# EAGLE design G021dec (EAGLE 6.6.0)
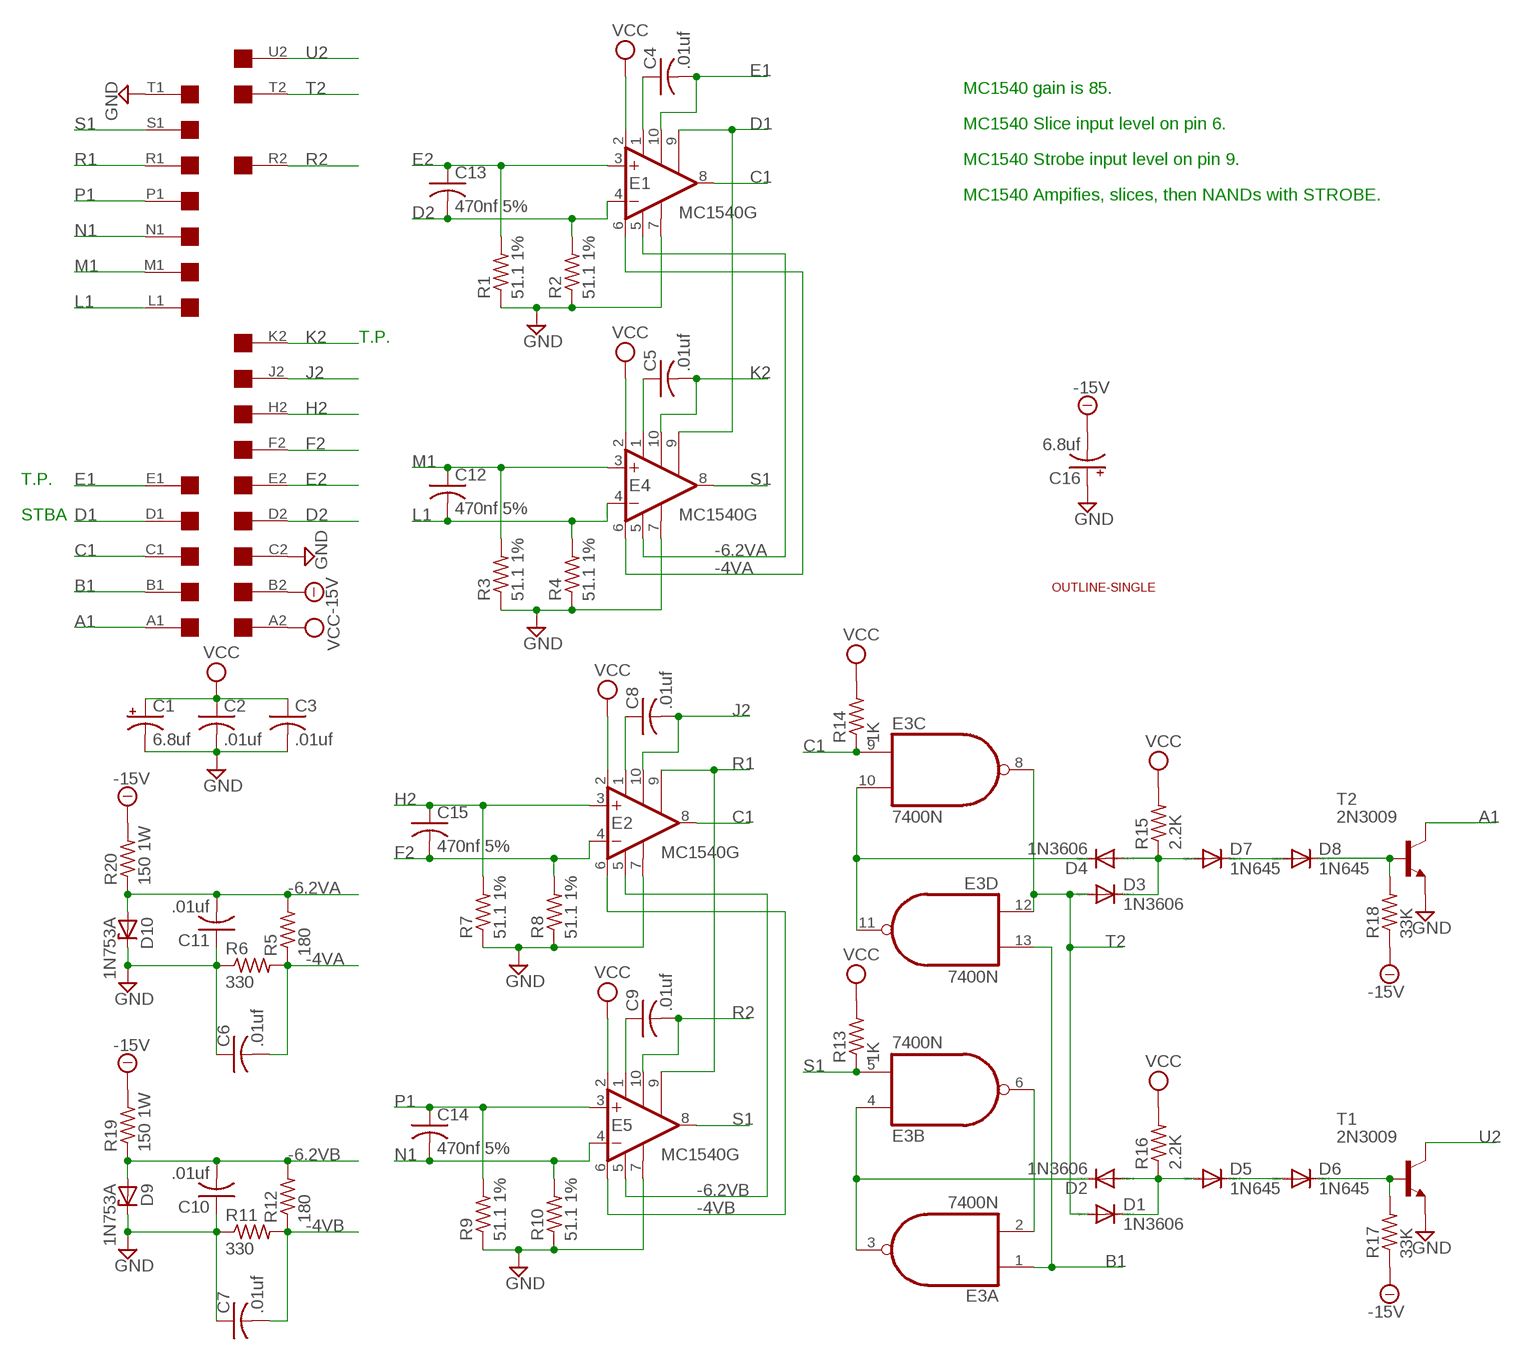
[diagram p0: schematic, sheet 1]

## Parts
C1  6.8uf  CPOL-USE15-5AXIAL  [E15-5]
C2  .01uf  C-US050-025X075  [C050-025X075]
C3  .01uf  C-US050-025X075  [C050-025X075]
C4  .01uf  C-US050-025X075  [C050-025X075]
C5  .01uf  C-US050-025X075  [C050-025X075]
C6  .01uf  C-US050-025X075  [C050-025X075]
C7  .01uf  C-US050-025X075  [C050-025X075]
C8  .01uf  C-US050-025X075  [C050-025X075]
C9  .01uf  C-US050-025X075  [C050-025X075]
C10  .01uf  C-US050-025X075  [C050-025X075]
C11  .01uf  C-US050-025X075  [C050-025X075]
C12  470nf 5%  C-US050-025X075  [C050-025X075]
C13  470nf 5%  C-US050-025X075  [C050-025X075]
C14  470nf 5%  C-US050-025X075  [C050-025X075]
C15  470nf 5%  C-US050-025X075  [C050-025X075]
C16  6.8uf  CPOL-USE15-5AXIAL  [E15-5]
D1  1N3606  1N4148DO35-10  [DO35-10]
D2  1N3606  1N4148DO35-10  [DO35-10]
D3  1N3606  1N4148DO35-10  [DO35-10]
D4  1N3606  1N4148DO35-10  [DO35-10]
D5  1N645  1N4148DO35-10  [DO35-10]
D6  1N645  1N4148DO35-10  [DO35-10]
D7  1N645  1N4148DO35-10  [DO35-10]
D8  1N645  1N4148DO35-10  [DO35-10]
D9  1N753A  ZENER-DIODEF126-10  [F126Z10]
D10  1N753A  ZENER-DIODEF126-10  [F126Z10]
E1  MC1540G  [602B]
E2  MC1540G  [602B]
E3  7400N  [DIL14]
E4  MC1540G  [602B]
E5  MC1540G  [602B]
R1  51.1 1%  R-US_0207/10  [0207/10]
R2  51.1 1%  R-US_0207/10  [0207/10]
R3  51.1 1%  R-US_0207/10  [0207/10]
R4  51.1 1%  R-US_0207/10  [0207/10]
R5  180  R-US_0207/10  [0207/10]
R6  330  R-US_0207/10  [0207/10]
R7  51.1 1%  R-US_0207/10  [0207/10]
R8  51.1 1%  R-US_0207/10  [0207/10]
R9  51.1 1%  R-US_0207/10  [0207/10]
R10  51.1 1%  R-US_0207/10  [0207/10]
R11  330  R-US_0207/10  [0207/10]
R12  180  R-US_0207/10  [0207/10]
R13  1K  R-US_0207/10  [0207/10]
R14  1K  R-US_0207/10  [0207/10]
R15  2.2K  R-US_0207/10  [0207/10]
R16  2.2K  R-US_0207/10  [0207/10]
R17  33K  R-US_0207/10  [0207/10]
R18  33K  R-US_0207/10  [0207/10]
R19  150 1W  R-US_0414/15  [0414/15]
R20  150 1W  R-US_0414/15  [0414/15]
T1  2N3009  2N3565  [TO92]
T2  2N3009  2N3565  [TO92]
U$1  SINGLE  [EDGE-CON2]
U$2  OUTLINE-SINGLE  [SINGLE]

## Nets
-4VA: C6.2 E1.6(SLICE) E4.6(SLICE) R5.1 R6.2
-4VB: C7.2 E2.6(SLICE) E5.6(SLICE) R11.2 R12.1
-6.2VA: C11.2 D10.A E1.5(V-) E4.5(V-) R5.2 R20.1
-6.2VB: C10.2 D9.A E2.5(V-) E5.5(V-) R12.2 R19.1
-15V: C16.- R17.1 R18.1 R19.2 R20.2 U$1.B2
A1: T2.1(C) U$1.A1
B1: E3.1(A:I0) E3.13(D:I1) U$1.B1
C1: E1.8(OUT) E2.8(OUT) E3.9(C:I0) R14.1 U$1.C1
D1: E1.9(ISTROBE) E4.9(ISTROBE) U$1.D1
D2: C13.2 E1.4(-IN) R2.2 U$1.D2
E1: C4.2 E1.10(CEXTB) U$1.E1
E2: C13.1 E1.3(+IN) R1.2 U$1.E2
F2: C15.2 E2.4(-IN) R8.2 U$1.F2
GND [supply]: C1.- C2.2 C3.2 C6.1 C7.1 C10.1 C11.1 C16.+ D9.C D10.C E1.7(GND) E2.7(GND) E4.7(GND) E5.7(GND) R1.1 R2.1 R3.1 R4.1 R6.1 R7.1 R8.1 R9.1 R10.1 R11.1 T1.3(E) T2.3(E) U$1.C2 U$1.T1
H2: C15.1 E2.3(+IN) R7.2 U$1.H2
J2: C8.2 E2.10(CEXTB) U$1.J2
K2: C5.2 E4.10(CEXTB) U$1.K2
L1: C12.2 E4.4(-IN) R4.2 U$1.L1
M1: C12.1 E4.3(+IN) R3.2 U$1.M1
N1: C14.2 E5.4(-IN) R10.2 U$1.N1
N$1: C4.1 E1.1(CEXTA)
N$2: C8.1 E2.1(CEXTA)
N$3: C5.1 E4.1(CEXTA)
N$4: C9.1 E5.1(CEXTA)
N$6: D1.C D2.A D5.A R16.1
N$7: D4.C E3.10(C:I1) E3.11(D:O)
N$8: D2.C E3.3(A:O) E3.4(B:I0)
N$9: E3.2(A:I1) E3.6(B:O)
N$10: D3.C D4.A D7.A R15.1
N$11: D7.C D8.A
N$12: D5.C D6.A
N$13: D8.C R18.2 T2.2(B)
N$14: D6.C R17.2 T1.2(B)
P1: C14.1 E5.3(+IN) R9.2 U$1.P1
R1: E2.9(ISTROBE) E5.9(ISTROBE) U$1.R1
R2: C9.2 E5.10(CEXTB) U$1.R2
S1: E3.5(B:I1) E4.8(OUT) E5.8(OUT) R13.1 U$1.S1
T2: D1.A D3.A E3.8(C:O) E3.12(D:I0) U$1.T2
U2: T1.1(C) U$1.U2
VCC [supply]: C1.+ C2.1 C3.1 E1.2(V+) E2.2(V+) E4.2(V+) E5.2(V+) R13.2 R14.2 R15.2 R16.2 U$1.A2
Unconnected: U$1.F1 U$1.H1 U$1.J1 U$1.K1 U$1.L2 U$1.M2 U$1.N2 U$1.P2 U$1.S2 U$1.U1 U$1.V1 U$1.V2

## Notes on the sheet
- MC1540 gain is 85.
- MC1540 Slice input level on pin 6.
- MC1540 Strobe input level on pin 9.
- MC1540 Ampifies, slices, then NANDs with STROBE.
- T.P.
- T.P.
- STBA

## Power pins joined to a net without a drawn wire
GND: E3.7(P:GND)
VCC: E3.14(P:VCC)

## Library data of the parts
C1 C16 = rcl:CPOL-US: POLARIZED CAPACITOR, American symbol
C2-C15 = rcl:C-US: CAPACITOR, American symbol
D1-D8 = diode:1N4148: DIODE high speed (Philips)
D9 D10 = diode:ZENER-DIODE: Z-Diode
E1 E2 E4 E5 = dec-con:MC1540: OP AMP
E3 = 74xx-us:74*00: Quad 2-input NAND gate
R1-R20 = rcl:R-US_: RESISTOR, American symbol
T1 T2 = transistor:2N3565: NPN TRANSISTOR
U$1 = dec-con:SINGLE: Single-Height DEC board
U$2 = dec-con:OUTLINE-*: Board outlines for DEC boards.

## Net classes
1 supply: width 0.762 mm, clearance 0.635 mm

## Board
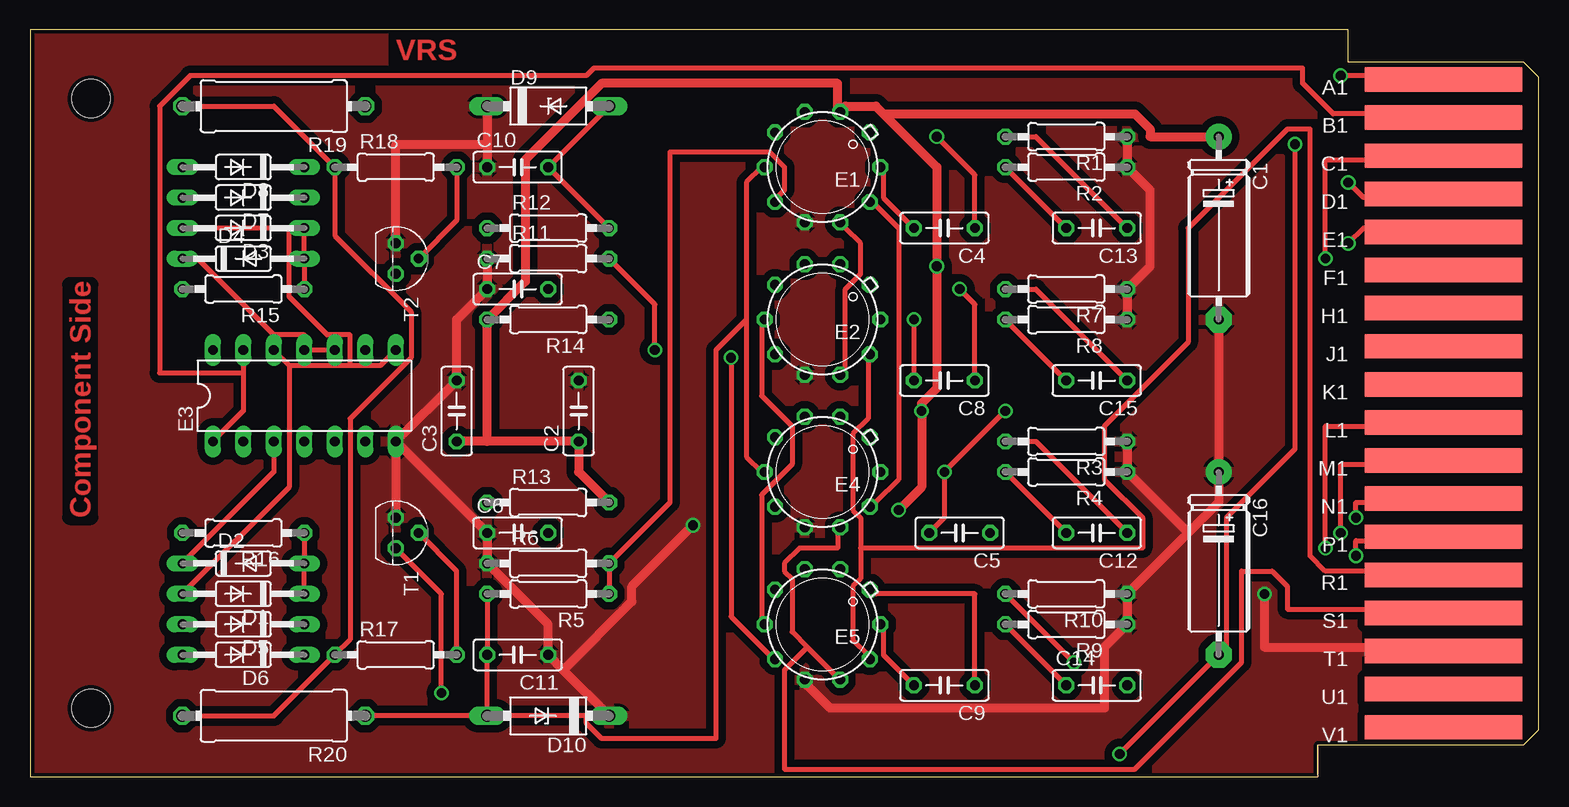
[diagram p1: board, top side]
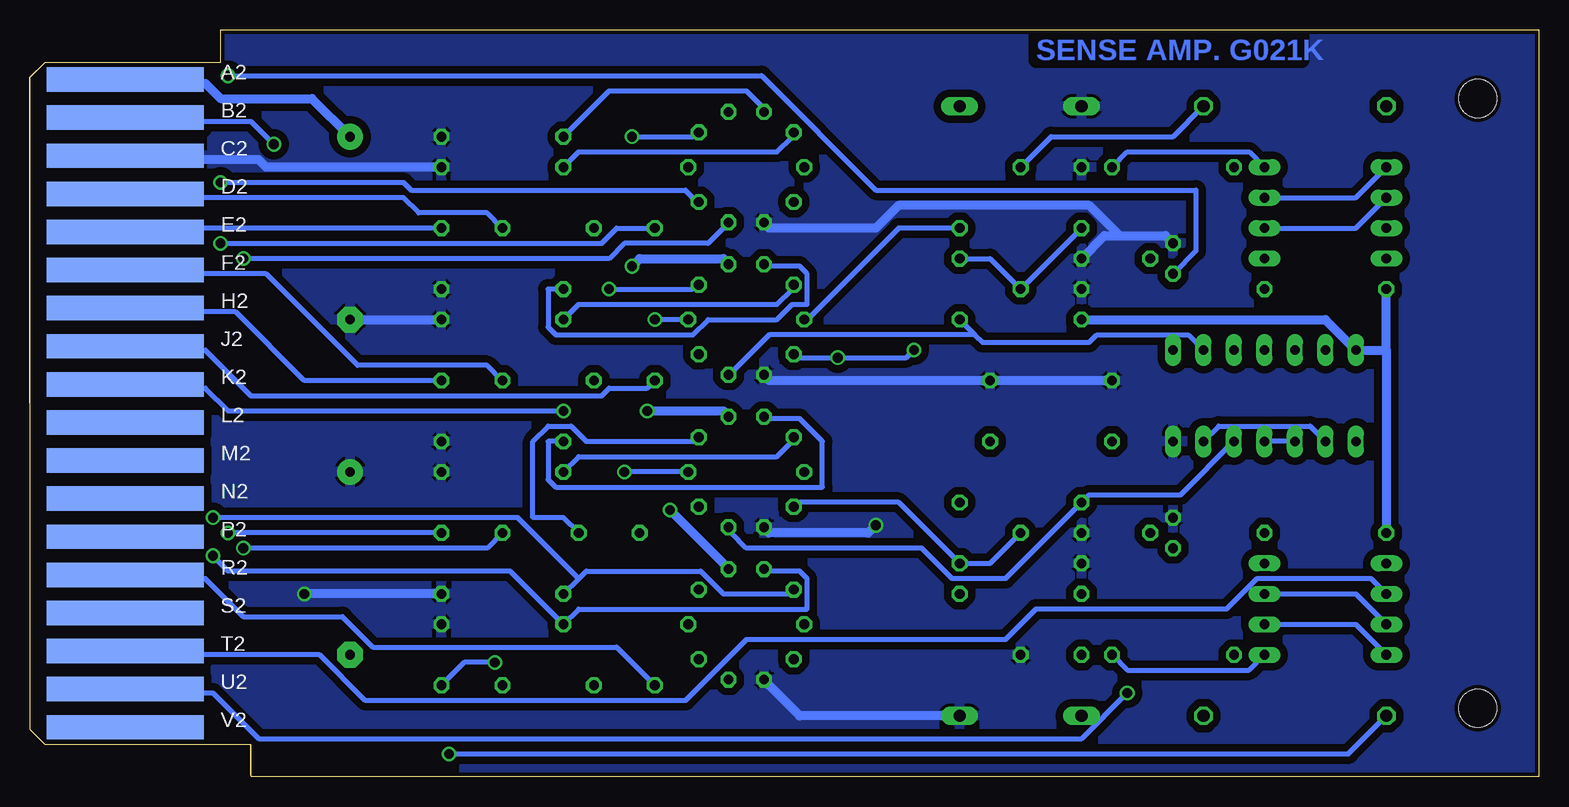
[diagram p2: board, bottom side, seen from below]

Size 125.73 x 62.23 mm. Coordinates in mm from the lower left corner, seen from the top.
Copper layers (1+16): Top 0.035mm / dielectric 1.5mm / Bottom 0.035mm
Design rules "16mils": minimum track width 16mil, minimum drill 32mil, track to track 15mil, track to pad 10mil, pad to pad 10mil, via to via 10mil, smd to smd 10mil, copper to edge 13mil, drill to drill 10mil, minimum pad ring 10mil, minimum via ring 8mil, stop-mask expansion 0mil, vias tented up to drill 0mil, thermal gap 10mil

### Footprints (pad centres in the part's own frame; a part is rotated, then mirrored left to right if it is on the bottom)
E15-5 = drill 0.813 pad 2.159: + -7.62,0 | drill 0.813 pad 2.159 octagon: - 7.62,0
C050-025X075 = drill 0.813 octagon: 1 -2.54,0; 2 2.54,0
DO35-10 = drill 0.813 long: A 5.08,0; C -5.08,0
F126Z10 = drill 1.016 long: A 5.08,0; C -5.08,0
602B = drill 0.813 octagon: 1 -3.954,-2.897; 2 -1.478,-4.605; 3 1.478,-4.605; 4 3.954,-2.897; 5 4.825,0; 6 3.954,2.897; 7 1.478,4.605; 8 -1.477,4.605; 9 -3.954,2.897; 10 -4.825,0
DIL14 = drill 0.813 long: 1 -7.62,-3.81; 2 -5.08,-3.81; 3 -2.54,-3.81; 4 0,-3.81; 5 2.54,-3.81; 6 5.08,-3.81; 7 7.62,-3.81; 8 7.62,3.81; 9 5.08,3.81; 10 2.54,3.81; 11 0,3.81; 12 -2.54,3.81; 13 -5.08,3.81; 14 -7.62,3.81
0207/10 = drill 0.813 octagon: 1 -5.08,0; 2 5.08,0
0414/15 = drill 1.016 octagon: 1 -7.62,0; 2 7.62,0
TO92 = drill 0.813 octagon: 1 1.27,0; 2 0,1.905; 3 -1.27,0
EDGE-CON2 = smd 13.106 x 2.032: A1 7.938,4.128; B1 7.938,7.303; C1 7.938,10.477; D1 7.938,13.652; E1 7.938,16.828; F1 7.938,20.003; H1 7.938,23.177; J1 7.938,26.352; K1 7.938,29.527; L1 7.938,32.703; M1 7.938,35.877; N1 7.938,39.053; P1 7.938,42.227; R1 7.938,45.403; S1 7.938,48.578; T1 7.938,51.752; U1 7.938,54.928; V1 7.938,58.102 | smd 13.106 x 2.032 bottom: A2 7.938,4.128; B2 7.938,7.303; C2 7.938,10.477; D2 7.938,13.652; E2 7.938,16.828; F2 7.938,20.003; H2 7.938,23.177; J2 7.938,26.352; K2 7.938,29.527; L2 7.938,32.703; M2 7.938,35.877; N2 7.938,39.053; P2 7.938,42.227; R2 7.938,45.403; S2 7.938,48.578; T2 7.938,51.752; U2 7.938,54.928; V2 7.938,58.102
SINGLE = hole 3.175: 120.65,56.515; 120.65,5.715

### Placement (x,y rotation side)
C1  99.06,45.72 270 top
C2  45.72,30.48 90 top
C3  35.56,30.48 90 top
C4  76.2,45.72 180 top
C5  77.47,20.32 180 top
C6  40.64,20.32 0 top
C7  40.64,40.64 0 top
C8  76.2,33.02 180 top
C9  76.2,7.62 180 top
C10  40.64,50.8 0 top
C11  40.64,10.16 180 top
C12  88.9,20.32 180 top
C13  88.9,45.72 180 top
C14  88.9,7.62 0 top
C15  88.9,33.02 180 top
C16  99.06,17.78 270 top
D1  17.78,15.24 180 top
D2  17.78,17.78 0 top
D3  17.78,45.72 180 top
D4  17.78,43.18 0 top
D5  17.78,12.7 180 top
D6  17.78,10.16 180 top
D7  17.78,48.26 180 top
D8  17.78,50.8 180 top
D9  43.18,55.88 0 top
D10  43.18,5.08 180 top
E1  66.04,50.8 180 top
E2  66.04,38.1 180 top
E3  22.86,31.75 0 top
E4  66.04,25.4 180 top
E5  66.04,12.7 180 top
R1  86.36,53.34 180 top
R2  86.36,50.8 180 top
R3  86.36,27.94 180 top
R4  86.36,25.4 180 top
R5  43.18,15.24 180 top
R6  43.18,17.78 0 top
R7  86.36,40.64 180 top
R8  86.36,38.1 180 top
R9  86.36,12.7 180 top
R10  86.36,15.24 180 top
R11  43.18,43.18 0 top
R12  43.18,45.72 0 top
R13  43.18,22.86 0 top
R14  43.18,38.1 180 top
R15  17.78,40.64 180 top
R16  17.78,20.32 180 top
R17  30.48,10.16 0 top
R18  30.48,50.8 0 top
R19  20.32,55.88 180 top
R20  20.32,5.08 180 top
T1  30.48,20.32 270 top
T2  30.48,43.18 270 top
U$1  125.73,62.23 180 top
U$2  125.73,62.23 180 top

### Tracks (layer width: path | path; a pad name or v marks a point on that pad's centre or on a via)
-4VA
  Top 0.406: R5.1 R6.2 53.34,22.86 53.34,52.07 61.59,52.07 62.87,50.8 62.87,48.9 62.23,48.26 E1.6
  Bottom 0.406: C6.2 45.72,17.78 R6.2 53.34,22.86 61.59,22.86 E4.6
-4VB  (via drill 0.81)
  Top 0.406: v58.42,34.92 58.42,13.34 61.59,10.16 E5.6 | R11.2 52.07,39.37 v52.07,35.56
  Bottom 0.406: R11.2 45.72,43.18 C7.2 R12.1 | E2.6 61.59,34.92 v58.42,34.92 52.7,34.92 v52.07,35.56
-6.2VA
  Top 0.406: R5.2 C11.2 D10.A | D10.A R20.1 | 59.69,38.1 59.69,49.53 60.96,50.8 E1.5 | 59.69,38.1 59.69,26.67 60.96,25.4 E4.5 | D10.A 46.35,5.08 46.35,4.45 47.62,3.17 57.15,3.17 57.15,35.56 59.69,38.1
-6.2VB
  Top 0.406: E5.5 60.96,12.7 60.96,23.5 63.5,26.04 63.5,29.21 60.96,31.75 60.96,38.1 E2.5 | D9.A C10.2 R12.2
  Bottom 0.406: R19.1 30.48,53.34 40.64,53.34 C10.2 | R12.2 53.34,45.72 60.96,38.1 E2.5
-15V  (via drill 0.81)
  Top 0.406: R20.2 20.32,5.08 R17.1 26.67,11.43 26.67,29.84 31.75,34.92 31.75,38.73 25.4,45.09 R18.1 20.32,55.88 R19.2 | v105.41,52.7 105.41,27.3 99.69,21.59 99.69,10.79 C16.- v90.81,1.91
  Bottom 0.406: v105.41,52.7 107.31,54.61 117.47,54.61 U$1.B2 | R20.2 15.88,1.91 v90.81,1.91
A1  (via drill 0.81)
  Top 0.406: v109.22,58.42 117.47,58.42 U$1.A1
  Bottom 0.406: T2.1 28.57,43.81 28.57,48.9 55.24,48.9 64.77,58.42 v109.22,58.42
B1
  Top 0.406: E3.1 17.78,30.48 17.78,33.66 | E3.13 17.78,33.66 | 17.78,33.66 10.79,33.66 10.79,55.88 13.34,58.42 46.35,58.42 46.99,59.05 106.05,59.05 106.05,57.78 108.58,55.24 117.47,55.24 U$1.B1
C1  (via drill 0.81)
  Top 0.406: E1.8 67.94,45.72 69.22,44.45 69.22,41.91 67.94,40.64 67.94,33.66 E2.8 | v107.95,43.18 107.95,51.44 117.47,51.44 U$1.C1
  Bottom 0.406: E3.9 29.21,36.83 36.83,36.83 37.47,36.2 46.35,36.2 46.99,36.83 | R14.1 46.99,36.83 | 46.99,36.83 64.14,36.83 67.31,33.66 E2.8 | v107.95,43.18 77.47,43.18 76.2,44.45 69.22,44.45 67.94,45.72 E1.8
D1  (via drill 0.81)
  Top 0.406: E4.9 70.48,22.86 72.39,24.77 72.39,45.72 70.48,47.62 E1.9 | v109.86,49.53 111.12,48.26 117.47,48.26 U$1.D1
  Bottom 0.406: v109.86,49.53 94.61,49.53 93.98,48.9 71.12,48.9 70.48,48.26 E1.9
D2
  Top 0.406: R2.2 C13.2
  Bottom 0.406: R2.2 80.01,52.07 63.5,52.07 62.23,53.34 E1.4 | C13.2 87.63,46.99 93.34,46.99 94.61,48.26 117.47,48.26 U$1.D2
E1  (via drill 0.81)
  Top 0.406: C4.2 71.12,48.26 71.12,50.8 E1.10 | v109.86,44.45 111.12,45.72 117.47,45.72 U$1.E1
  Bottom 0.406: C4.2 76.83,45.72 78.11,44.45 v109.86,44.45
E2
  Top 0.406: C13.1 83.82,53.34 R1.2
  Bottom 0.406: R1.2 77.47,57.15 66.04,57.15 64.77,55.88 E1.3 | C13.1 117.47,45.72 U$1.E2
F2
  Top 0.406: R8.2 C15.2
  Bottom 0.406: R8.2 80.01,39.37 63.5,39.37 62.23,40.64 E2.4 | C15.2 87.63,34.29 98.42,34.29 106.05,41.91 117.47,41.91 U$1.F2
GND  (via drill 0.81)
  Top 0.762: D9.C 38.1,52.7 | 38.1,52.7 C10.1 | R11.1 C7.1 35.56,38.1 C3.2 E3.7 | 38.1,52.7 30.48,52.7 T2.3 | D10.C 44.45,8.89 | 44.45,8.89 C11.1 43.18,12.7 R6.1 C6.1 E3.7 | v55.24,20.95 50.16,15.88 50.16,14.61 44.45,8.89 | E3.7 T1.3 | R3.1 R4.1 96.52,20.32 | 96.52,20.32 99.06,22.86 C16.+ C1.- | 96.52,20.32 R10.1 R9.1 89.53,10.79 89.53,5.71 66.67,5.71 64.77,7.62 E5.7 | R1.1 R2.1 93.34,48.9 93.34,42.55 R7.1 R8.1 | v102.87,15.24 102.87,10.79 117.47,10.79 U$1.T1
  Bottom 0.762: T2.3 31.11,45.09 34.92,45.09 | 34.92,45.09 36.2,45.09 R11.1 | 34.92,45.09 37.47,47.62 53.34,47.62 55.24,45.72 64.14,45.72 E1.7 | D10.C 61.59,5.08 64.14,7.62 E5.7 | v55.24,20.95 55.88,20.32 64.14,20.32 E4.7 | C3.2 C2.2 64.14,33.02 E2.7 | C1.- R8.1 | R10.1 v102.87,15.24 | R2.1 106.05,50.8 106.68,51.44 117.47,51.44 U$1.C2
  pour Top: 0,62.23 111.76,62.23 111.76,0 0,0
  pour Bottom: 0,62.23 111.76,62.23 111.76,0 0,0
H2
  Top 0.406: C15.1 83.82,40.64 R7.2
  Bottom 0.406: R7.2 82.55,40.64 82.55,37.47 81.92,36.83 70.48,36.83 69.22,38.1 63.5,38.1 62.23,39.37 60.96,39.37 60.96,41.91 61.59,42.55 64.14,42.55 E2.3 | C15.1 102.87,33.02 108.58,38.73 117.47,38.73 U$1.H2
J2  (via drill 0.81)
  Top 0.406: v73.66,38.1 C8.2
  Bottom 0.406: E2.10 v73.66,38.1 | C8.2 74.3,32.38 77.47,32.38 78.11,31.75 107.31,31.75 111.12,35.56 117.47,35.56 U$1.J2
K2  (via drill 0.81)
  Top 0.406: C5.2 76.2,21.59 v76.2,25.4 v81.28,30.48
  Bottom 0.406: E4.10 v76.2,25.4 | v81.28,30.48 109.22,30.48 111.12,32.38 117.47,32.38 U$1.K2
L1  (via drill 0.81)
  Top 0.406: R4.2 C12.2 | v107.95,19.05 107.95,29.21 117.47,29.21 U$1.L1
  Bottom 0.406: R4.2 80.01,26.67 63.5,26.67 62.23,27.94 E4.4 | v107.95,19.05 87.63,19.05 C12.2
M1  (via drill 0.81)
  Top 0.406: C12.1 83.82,27.94 R3.2 | v109.22,20.32 109.22,26.04 117.47,26.04 U$1.M1
  Bottom 0.406: R3.2 82.55,27.94 82.55,24.77 81.92,24.13 59.69,24.13 59.69,27.94 61.59,29.84 64.14,29.84 E4.3 | C12.1 v109.22,20.32
N1  (via drill 0.81)
  Top 0.406: R10.2 v87,9.53 | v110.49,21.59 110.49,22.86 117.47,22.86 U$1.N1
  Bottom 0.406: R10.2 80.01,16.51 | 80.01,16.51 79.38,17.14 69.85,17.14 67.94,15.24 62.23,15.24 E5.4 | C14.2 89.53,9.53 v87,9.53 | v110.49,21.59 85.09,21.59 80.01,16.51
N$1  (via drill 0.81)
  Top 0.406: v75.56,53.34 78.74,50.16 C4.1
  Bottom 0.406: v75.56,53.34 70.48,53.34 E1.1
N$2  (via drill 0.81)
  Top 0.406: v77.47,40.64 78.74,39.37 C8.1
  Bottom 0.406: v77.47,40.64 70.48,40.64 E2.1
N$3
  Bottom 0.406: C5.1 81.28,21.59 83.82,21.59 83.82,27.94 82.55,29.21 80.64,29.21 79.38,27.94 70.48,27.94 E4.1
N$4
  Top 0.406: C9.1 78.74,15.24 70.48,15.24 E5.1
N$6
  Top 0.406: R16.1 D2.A D1.C
  Bottom 0.406: D5.A 15.24,15.24 D1.C
N$7
  Top 0.406: E3.10 E3.11 22.86,36.83 20.32,36.83 13.97,43.18 D4.C
N$8
  Top 0.406: D2.C 20.32,25.4 E3.3
  Bottom 0.406: E3.3 E3.4
N$9
  Bottom 0.406: E3.2 19.05,29.21 26.67,29.21 E3.6
N$10
  Top 0.406: R15.1 D4.A D3.C
  Bottom 0.406: D7.A 15.24,45.72 D3.C
N$11
  Bottom 0.406: D8.A 15.24,48.26 D7.C
N$12
  Bottom 0.406: D6.A 15.24,12.7 D5.C
N$13
  Top 0.406: T2.2 35.56,46.35 R18.2
  Bottom 0.406: D8.C 24.13,52.07 34.29,52.07 R18.2
N$14
  Top 0.406: T1.2 35.56,17.14 R17.2
  Bottom 0.406: D6.C 24.13,8.89 34.29,8.89 R17.2
P1  (via drill 0.81)
  Top 0.406: R9.2 C14.1 | v110.49,18.41 110.49,19.68 117.47,19.68 U$1.P1
  Bottom 0.406: E5.3 64.14,17.14 61.59,17.14 60.96,16.51 60.96,13.97 80.01,13.97 R9.2 85.72,17.14 109.22,17.14 v110.49,18.41
R1
  Top 0.406: 69.22,19.05 69.22,21.59 68.58,22.23 68.58,28.57 69.85,29.84 69.85,34.92 E2.9 | 69.22,19.05 69.22,16.51 68.58,15.88 68.58,11.43 69.85,10.16 E5.9 | 69.22,19.05 92.71,19.05 92.71,21.59 89.53,24.77 89.53,29.21 96.52,36.2 96.52,45.72 104.78,53.98 106.68,53.98 106.68,18.41 107.95,17.14 117.47,17.14 U$1.R1
R2
  Top 0.406: C9.2 71.12,10.16 71.12,12.7 E5.10
  Bottom 0.406: C9.2 76.83,10.79 97.16,10.79 99.69,13.34 107.95,13.34 111.12,16.51 117.47,16.51 U$1.R2
S1
  Top 0.406: 64.77,10.79 63.5,12.06 63.5,16.51 62.87,17.14 62.87,17.78 64.14,19.05 67.31,19.05 67.31,20.32 E4.8 | 64.77,10.79 67.31,8.26 E5.8 | 64.77,10.79 62.87,8.89 62.87,0.64 92.08,0.64 100.97,9.53 100.97,17.14 103.5,17.14 104.78,15.88 104.78,13.97 117.47,13.97 U$1.S1
  Bottom 0.406: E3.5 29.84,23.5 37.47,23.5 R13.1 44.45,16.51 48.9,16.51 51.44,19.05 66.04,19.05 67.31,20.32 E4.8
T2
  Top 0.406: D1.A 21.59,24.13 21.59,34.29 | E3.12 21.59,34.29 | E3.8 29.21,34.29 26.67,34.29 | 21.59,34.29 26.67,34.29 | D3.A 21.59,45.72 21.59,40.01 24.77,36.83 26.67,36.83 26.67,34.29
  Bottom 0.406: D1.A 13.97,16.51 23.5,16.51 26.04,13.97 41.91,13.97 44.45,11.43 66.04,11.43 71.12,6.35 97.79,6.35 101.6,10.16 117.47,10.16 U$1.T2
U2  (via drill 0.81)
  Top 0.406: T1.1 34.29,15.24 v34.29,6.99
  Bottom 0.406: v34.29,6.99 38.1,3.17 106.68,3.17 110.49,6.99 117.47,6.99 U$1.U2
VCC  (via drill 0.81)
  Top 0.762: 38.1,27.94 C2.1 45.72,25.4 R13.2 | 38.1,27.94 C3.1 | 38.1,27.94 R14.2 41.27,41.27 41.27,51.44 47.62,57.78 67.31,57.78 67.31,55.88 E1.2 67.94,55.88 70.48,55.88 71.12,55.24 | v72.39,22.23 74.3,24.13 v74.3,30.48 74.3,31.11 75.56,32.38 v75.56,42.55 75.56,50.8 71.12,55.24 | C1.+ 93.34,53.34 93.34,53.98 92.08,55.24 71.12,55.24
  Bottom 0.762: 12.7,35.56 R16.2 | 12.7,35.56 E3.14 17.78,38.1 R14.2 | 12.7,35.56 R15.2 | C1.+ 102.23,56.52 109.86,56.52 111.12,57.78 117.47,57.78 U$1.A2 | v72.39,22.23 67.94,17.78 E5.2 | v74.3,30.48 67.94,30.48 E4.2 | v75.56,42.55 74.93,43.18 67.94,43.18 E2.2

### Text on the board
Top: VRS | Component Side
Bottom: SENSE AMP. G021K